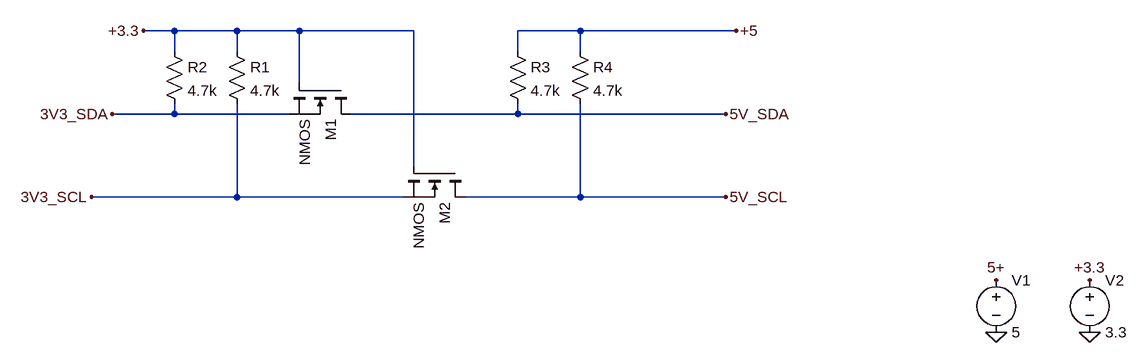
[diagram p0: schematic i2c_level_shift.asc]
i2c_level_shift.asc, the LTspice schematic file:
Version 4
SHEET 1 1408 680
WIRE -64 16 -112 16
WIRE 32 16 -64 16
WIRE 128 16 32 16
WIRE 304 16 128 16
WIRE 560 16 464 16
WIRE 800 16 560 16
WIRE -64 48 -64 16
WIRE 32 48 32 16
WIRE 464 48 464 16
WIRE 560 48 560 16
WIRE 128 96 128 16
WIRE -64 144 -64 128
WIRE -64 144 -160 144
WIRE 112 144 -64 144
WIRE 464 144 464 128
WIRE 464 144 208 144
WIRE 784 144 464 144
WIRE 304 224 304 16
WIRE 32 272 32 128
WIRE 32 272 -192 272
WIRE 288 272 32 272
WIRE 560 272 560 128
WIRE 560 272 384 272
WIRE 784 272 560 272
FLAG 1200 480 0
FLAG 1344 480 0
FLAG 1200 400 5+
FLAG 1344 400 +3.3
FLAG -112 16 +3.3
FLAG 800 16 +5
FLAG -192 272 3V3_SCL
FLAG -160 144 3V3_SDA
FLAG 784 144 5V_SDA
FLAG 784 272 5V_SCL
SYMBOL nmos 208 96 R90
SYMATTR InstName M1
SYMBOL nmos 384 224 R90
SYMATTR InstName M2
SYMBOL voltage 1200 384 R0
WINDOW 123 0 0 Left 0
WINDOW 39 0 0 Left 0
SYMATTR InstName V1
SYMATTR Value 5
SYMBOL voltage 1344 384 R0
WINDOW 123 0 0 Left 0
WINDOW 39 0 0 Left 0
SYMATTR InstName V2
SYMATTR Value 3.3
SYMBOL res 16 32 R0
SYMATTR InstName R1
SYMATTR Value 4.7k
SYMBOL res -80 32 R0
SYMATTR InstName R2
SYMATTR Value 4.7k
SYMBOL res 448 32 R0
SYMATTR InstName R3
SYMATTR Value 4.7k
SYMBOL res 544 32 R0
SYMATTR InstName R4
SYMATTR Value 4.7k

The netlist it stands for:
* i2c_level_shift.asc
M1 5V_SDA +3.3 3V3_SDA 3V3_SDA NMOS
M2 5V_SCL +3.3 3V3_SCL 3V3_SCL NMOS
V1 5+ 0 5
V2 +3.3 0 3.3
R1 +3.3 3V3_SCL 4.7k
R2 +3.3 3V3_SDA 4.7k
R3 +5 5V_SDA 4.7k
R4 +5 5V_SCL 4.7k
.model NMOS NMOS
.model PMOS PMOS
.lib standard.mos
.backanno
.end